# Altium schematic sheet ZYNQ_PL_Bank_34.SchDoc
size A4; DocumentNumber: 6; SheetNumber: 6; SheetTotal: 47
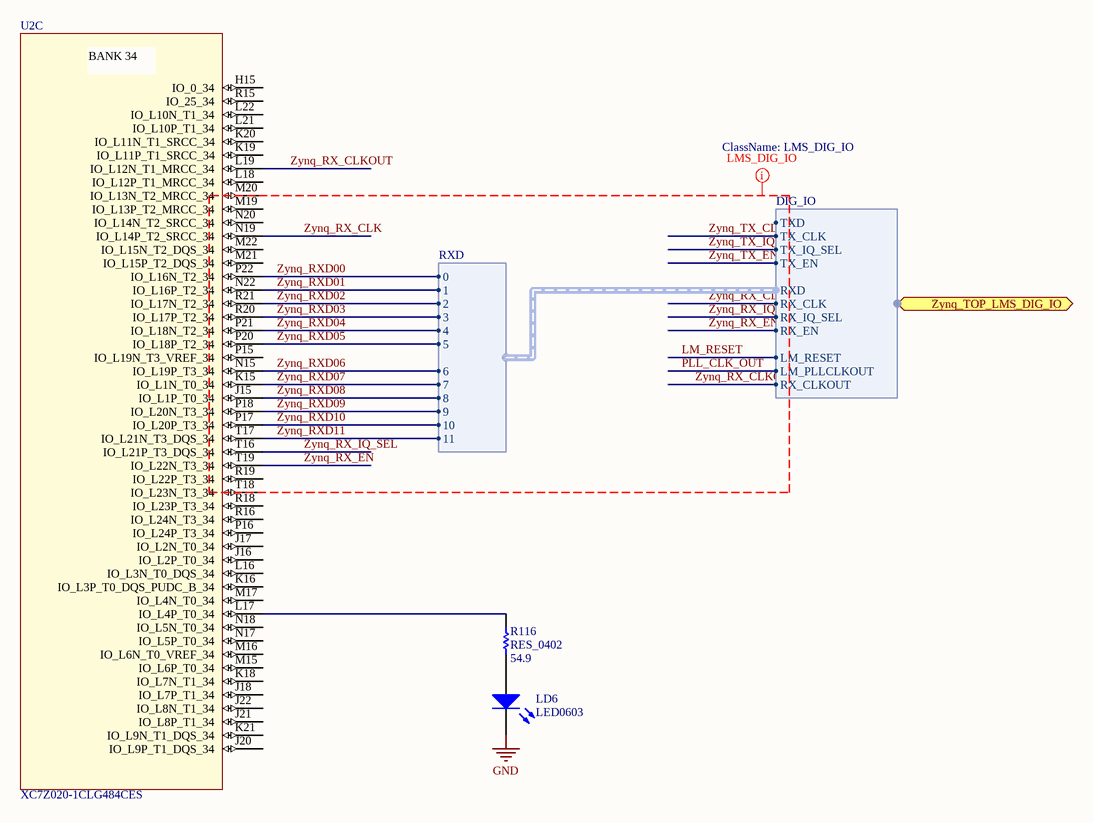
[diagram p0: ZYNQ_PL_Bank_34.SchDoc]

## Parts
LD6  LED0603  [LED0603(1608)_HSMG-C190]
R116  RES_0402  value 54.9  [RESC0402(1005)_N]
U2  XC7Z020-1CLG484CES  [ZYNQ_xc7z020clg484pkg_BGA-484]  (part C of 10)

## Ports
Zynq_TOP_LMS_DIG_IO (harness DIG_IO)

## Harnesses
DIG_IO: TXD, TX_CLK, TX_IQ_SEL, TX_EN, RXD, RX_CLK, RX_IQ_SEL, RX_EN, LM_RESET, LM_PLLCLKOUT, RX_CLKOUT
RXD: 0, 1, 2, 3, 4, 5, 6, 7, 8, 9, 10, 11

## Nets
GND: LD6.1(K)
LM_RESET: port Zynq_TOP_LMS_DIG_IO.LM_RESET
PLL_CLK_OUT: port Zynq_TOP_LMS_DIG_IO.LM_PLLCLKOUT
Zynq_RX_CLK: U2.N19(IO_L14P_T2_SRCC_34) ; port Zynq_TOP_LMS_DIG_IO.RX_CLK
Zynq_RX_CLKOUT: U2.L19(IO_L12N_T1_MRCC_34) ; port Zynq_TOP_LMS_DIG_IO.RX_CLKOUT
Zynq_RX_EN: U2.T19(IO_L22N_T3_34) ; port Zynq_TOP_LMS_DIG_IO.RX_EN
Zynq_RX_IQ_SEL: U2.T16(IO_L21P_T3_DQS_34) ; port Zynq_TOP_LMS_DIG_IO.RX_IQ_SEL
Zynq_RXD00: U2.P22(IO_L16N_T2_34) ; harness RXD.0
Zynq_RXD01: U2.N22(IO_L16P_T2_34) ; harness RXD.1
Zynq_RXD02: U2.R21(IO_L17N_T2_34) ; harness RXD.2
Zynq_RXD03: U2.R20(IO_L17P_T2_34) ; harness RXD.3
Zynq_RXD04: U2.P21(IO_L18N_T2_34) ; harness RXD.4
Zynq_RXD05: U2.P20(IO_L18P_T2_34) ; harness RXD.5
Zynq_RXD06: U2.N15(IO_L19P_T3_34) ; harness RXD.6
Zynq_RXD07: U2.K15(IO_L1N_T0_34) ; harness RXD.7
Zynq_RXD08: U2.J15(IO_L1P_T0_34) ; harness RXD.8
Zynq_RXD09: U2.P18(IO_L20N_T3_34) ; harness RXD.9
Zynq_RXD10: U2.P17(IO_L20P_T3_34) ; harness RXD.10
Zynq_RXD11: U2.T17(IO_L21N_T3_DQS_34) ; harness RXD.11
Zynq_TX_CLK: port Zynq_TOP_LMS_DIG_IO.TX_CLK
Zynq_TX_EN: port Zynq_TOP_LMS_DIG_IO.TX_EN
Zynq_TX_IQ_SEL: port Zynq_TOP_LMS_DIG_IO.TX_IQ_SEL
NetLD6_2: LD6.2(A) R116.1
NetR116_2: R116.2 U2.L17(IO_L4P_T0_34)

Not connected (* = marked no-connect by the designer): U2 H15(IO_0_34) J16(IO_L2P_T0_34) J17(IO_L2N_T0_34) J18(IO_L7P_T1_34) J20(IO_L9P_T1_DQS_34) J21(IO_L8P_T1_34) J22(IO_L8N_T1_34) K16(IO_L3P_T0_DQS_PUDC_B_34) K18(IO_L7N_T1_34) K19(IO_L11P_T1_SRCC_34) K20(IO_L11N_T1_SRCC_34) K21(IO_L9N_T1_DQS_34) L16(IO_L3N_T0_DQS_34) L18(IO_L12P_T1_MRCC_34) L21(IO_L10P_T1_34) L22(IO_L10N_T1_34) M15(IO_L6P_T0_34) M16(IO_L6N_T0_VREF_34) M17(IO_L4N_T0_34) M19(IO_L13P_T2_MRCC_34) M20(IO_L13N_T2_MRCC_34) M21(IO_L15P_T2_DQS_34) M22(IO_L15N_T2_DQS_34) N17(IO_L5P_T0_34) N18(IO_L5N_T0_34) N20(IO_L14N_T2_SRCC_34) P15(IO_L19N_T3_VREF_34) P16(IO_L24P_T3_34) R15(IO_25_34) R16(IO_L24N_T3_34) R18(IO_L23P_T3_34) R19(IO_L22P_T3_34) T18(IO_L23N_T3_34)

## Layout directives
net class LMS_DIG_IO: LM_RESET, PLL_CLK_OUT, Zynq_RX_CLK, Zynq_RX_CLKOUT, Zynq_RX_EN, Zynq_RX_IQ_SEL, Zynq_RXD00, Zynq_RXD01, Zynq_RXD02, Zynq_RXD03, Zynq_RXD04, Zynq_RXD05, Zynq_RXD06, Zynq_RXD07, Zynq_RXD08, Zynq_RXD09, Zynq_RXD10, Zynq_RXD11, Zynq_TX_CLK, Zynq_TX_EN, Zynq_TX_IQ_SEL

## Notes on the sheet
- (in symbol XC7Z020-1CLG484CES, part C) BANK 34

## Library data of the parts
LD6 = "HSMG-C190": LED 570NM GREEN DIFF 0603 SMD; Manufacturer: Avago; Value: "HSMG-C190 green"; Part Number: "HSMG-C190"; Footprint Ref: LED0603(1608); Library Ref: LED0603
R116 = ERJ-2RKF54R9X: RES 54.9 OHM 1/10W 1% 0402 SMD; Manufacturer: Panasonic Electronic Components; Tolerance: *; Part Number: ERJ-2RKF54R9X; Footprint Ref: RESC0402(1005)_N; Library Ref: RES_0402
U2 = XC7Z020-1CLG484CES: XC7Z020-1CLG484CES, Zynq-7000 All Programmable SoC; Manufacturer: Xilinx; Part Number: XC7Z020-1CLG484CES